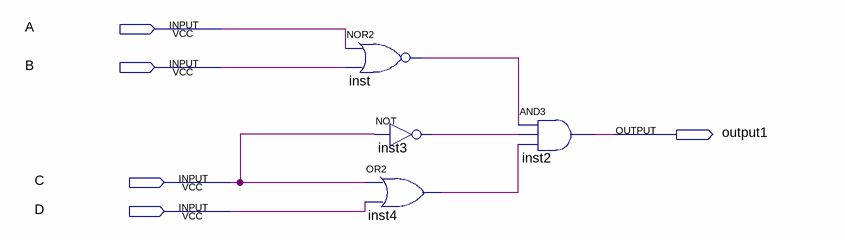
[diagram p0: schematic sheet]
// Quartus schematic Component2.bdf as structural Verilog: 4 symbols, 5 pins
module Component2 (
  input  A,
  input  B,
  input  C,
  input  D,
  output output1
);

  wire inst3_out, inst4_out, inst_out;

  nor inst (inst_out, A, B);
  not inst3 (inst3_out, C);
  or inst4 (inst4_out, C, D);
  and inst2 (output1, inst_out, inst3_out, inst4_out);
endmodule
